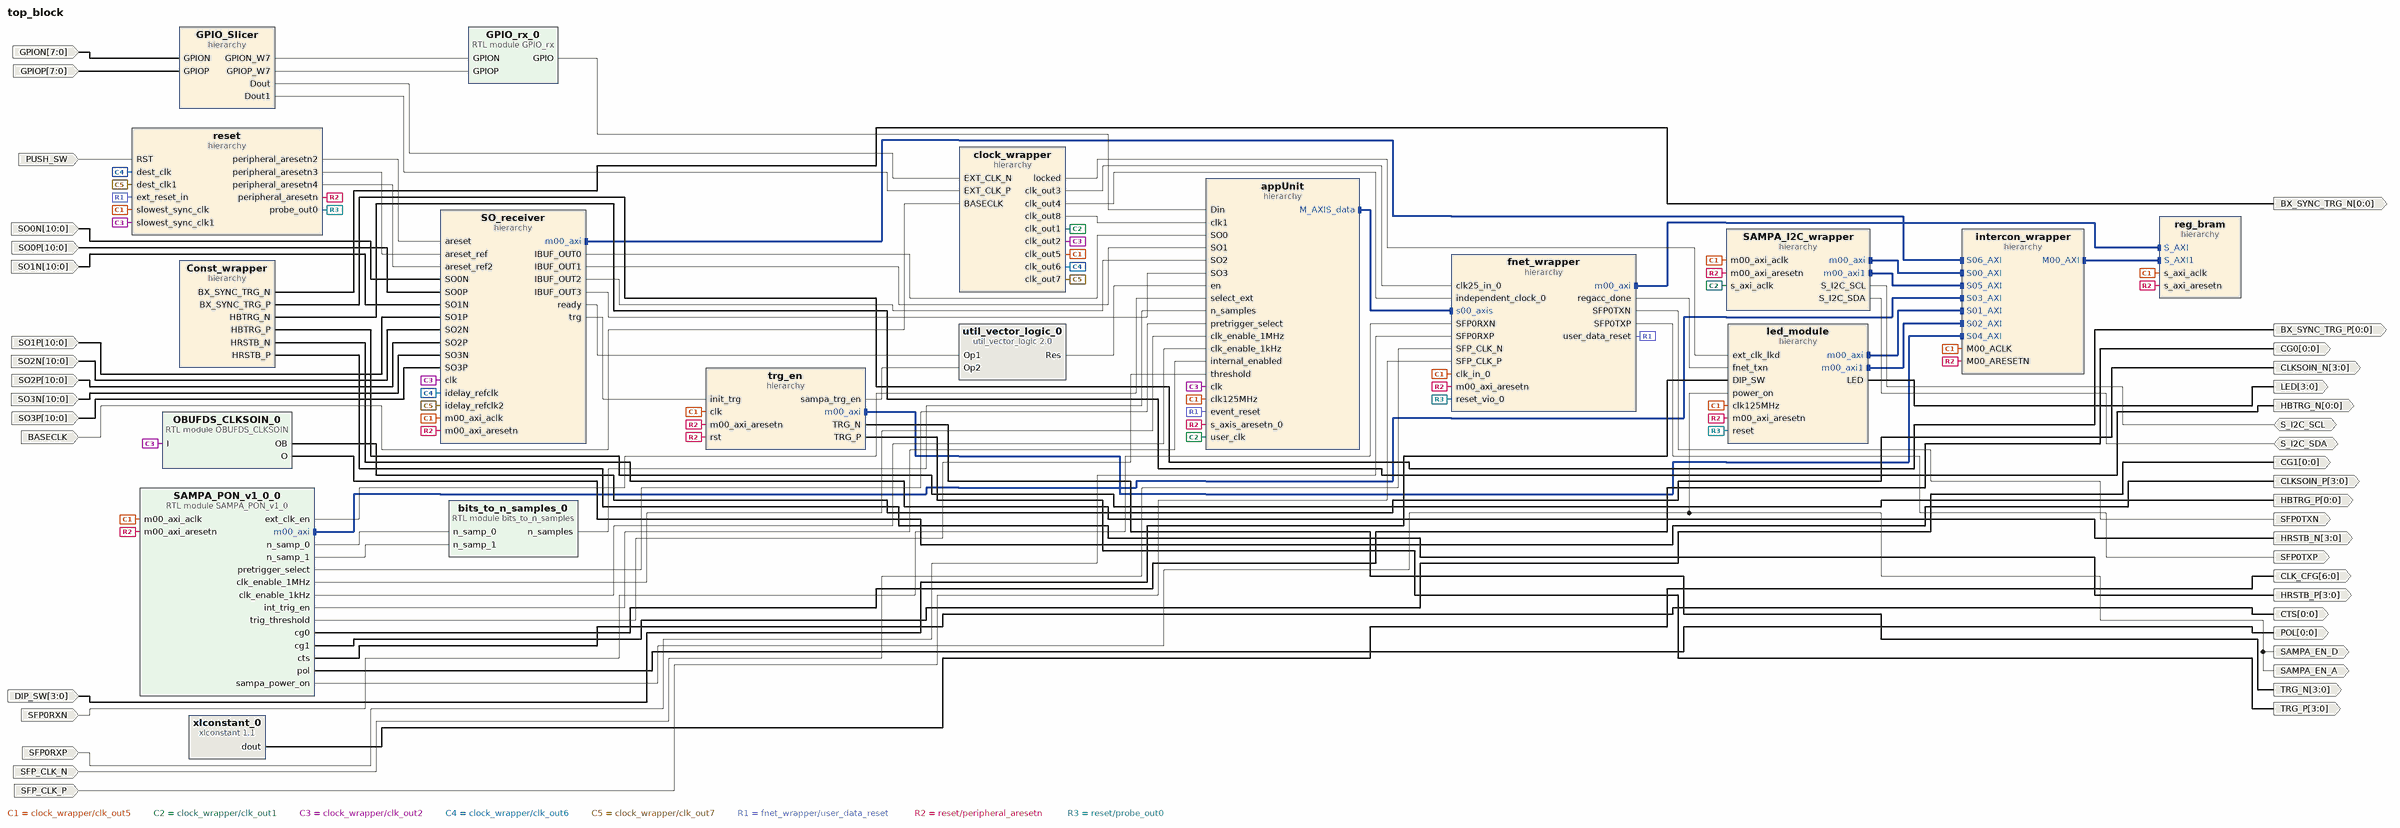
[diagram p0: block diagram of the top level]
# Vivado block design top_block, xcau15p-sbvb484-1-i, Vivado 2022.2
create_bd_design top_block

create_bd_port -dir I SFP0RXN
create_bd_port -dir O SFP0TXP
create_bd_port -dir O SFP0TXN
create_bd_port -dir I SFP0RXP
create_bd_port -dir I -type clk BASECLK
set_property -dict {CONFIG.FREQ_HZ 40000000} [get_bd_ports BASECLK]
create_bd_port -dir O -from 3 -to 0 LED
create_bd_port -dir I -from 10 -to 0 -type data SO1P
create_bd_port -dir I -from 10 -to 0 -type data SO1N
create_bd_port -dir I -from 10 -to 0 -type data SO0N
create_bd_port -dir I -from 10 -to 0 -type data SO0P
create_bd_port -dir I -from 10 -to 0 -type data SO2N
create_bd_port -dir I -from 10 -to 0 -type data SO2P
create_bd_port -dir I -from 10 -to 0 -type data SO3N
create_bd_port -dir I -from 10 -to 0 -type data SO3P
create_bd_port -dir O -from 3 -to 0 TRG_N
create_bd_port -dir O -from 3 -to 0 TRG_P
create_bd_port -dir O SAMPA_EN_A
create_bd_port -dir O SAMPA_EN_D
create_bd_port -dir O -from 6 -to 0 CLK_CFG
create_bd_port -dir O -from 3 -to 0 -type clk CLKSOIN_P
create_bd_port -dir O -from 3 -to 0 -type clk CLKSOIN_N
create_bd_port -dir I -type rst PUSH_SW
create_bd_port -dir IO S_I2C_SDA
create_bd_port -dir IO S_I2C_SCL
create_bd_port -dir O -from 0 -to 0 BX_SYNC_TRG_P
create_bd_port -dir O -from 0 -to 0 BX_SYNC_TRG_N
create_bd_port -dir O -from 0 -to 0 HBTRG_P
create_bd_port -dir O -from 0 -to 0 HBTRG_N
create_bd_port -dir O -from 3 -to 0 HRSTB_N
create_bd_port -dir O -from 3 -to 0 HRSTB_P
create_bd_port -dir O -from 0 -to 0 CTS
create_bd_port -dir O -from 0 -to 0 POL
create_bd_port -dir O -from 0 -to 0 CG0
create_bd_port -dir O -from 0 -to 0 CG1
create_bd_port -dir I -from 3 -to 0 DIP_SW
create_bd_port -dir I -type clk SFP_CLK_P
set_property -dict {CONFIG.FREQ_HZ 156250000} [get_bd_ports SFP_CLK_P]
create_bd_port -dir I -type clk SFP_CLK_N
set_property -dict {CONFIG.FREQ_HZ 156250000} [get_bd_ports SFP_CLK_N]
create_bd_port -dir I -from 7 -to 0 GPIOP
create_bd_port -dir I -from 7 -to 0 GPION

create_bd_cell -type hier led_module
create_bd_cell -type hier reset
create_bd_cell -type hier reg_bram
create_bd_cell -type hier SAMPA_I2C_wrapper
create_bd_cell -type ip -vlnv xilinx.com:ip:xlconstant:1.1 xlconstant_0
set_property -dict {CONFIG.CONST_VAL 0b1010011 CONFIG.CONST_WIDTH 7} [get_bd_cells xlconstant_0]
create_bd_cell -type hier appUnit
create_bd_cell -type hier fnet_wrapper
create_bd_cell -type hier clock_wrapper
create_bd_cell -type hier SO_receiver
create_bd_cell -type hier trg_en
create_bd_cell -type hier intercon_wrapper
create_bd_cell -type module -reference OBUFDS_CLKSOIN OBUFDS_CLKSOIN_0
create_bd_cell -type ip -vlnv xilinx.com:ip:util_vector_logic:2.0 util_vector_logic_0
set_property -dict {CONFIG.C_SIZE 1} [get_bd_cells util_vector_logic_0]
create_bd_cell -type module -reference bits_to_n_samples bits_to_n_samples_0
create_bd_cell -type hier Const_wrapper
create_bd_cell -type module -reference SAMPA_PON_v1_0 SAMPA_PON_v1_0_0
set_property -dict [list \
  CONFIG.C_M00_AXI_TARGET_SLAVE_BASE_ADDR 0xC0000000 \
  CONFIG.POWER_ON_ADDRESS 0x00000800 \
] [get_bd_cells SAMPA_PON_v1_0_0]
create_bd_cell -type module -reference GPIO_rx GPIO_rx_0
create_bd_cell -type hier GPIO_Slicer

# ---- hierarchy /led_module ----
current_bd_instance /led_module
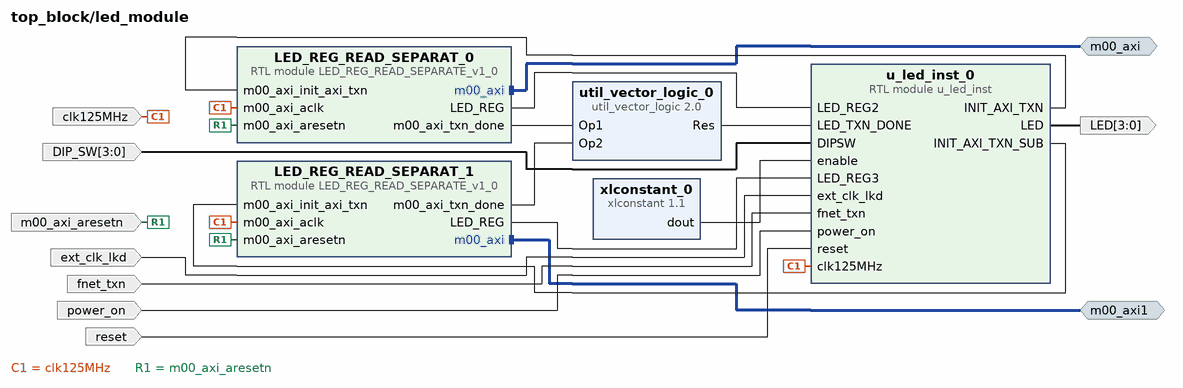
[diagram p1: block diagram inside /led_module]
create_bd_intf_pin -mode Master -vlnv xilinx.com:interface:aximm_rtl:1.0 m00_axi
create_bd_intf_pin -mode Master -vlnv xilinx.com:interface:aximm_rtl:1.0 m00_axi1
create_bd_pin -dir I -type rst reset
create_bd_pin -dir O -from 3 -to 0 LED
create_bd_pin -dir I clk125MHz
create_bd_pin -dir I -type rst m00_axi_aresetn
create_bd_pin -dir I fnet_txn
create_bd_pin -dir I power_on
create_bd_pin -dir I -from 3 -to 0 DIP_SW
create_bd_pin -dir I ext_clk_lkd

create_bd_cell -type ip -vlnv xilinx.com:ip:util_vector_logic:2.0 util_vector_logic_0
set_property -dict {CONFIG.C_OPERATION or CONFIG.C_SIZE 1} [get_bd_cells util_vector_logic_0]
create_bd_cell -type ip -vlnv xilinx.com:ip:xlconstant:1.1 xlconstant_0
create_bd_cell -type module -reference LED_REG_READ_SEPARATE_v1_0 LED_REG_READ_SEPARAT_0
set_property -dict [list \
  CONFIG.C_M00_AXI_TARGET_SLAVE_BASE_ADDR 0xC0000000 \
  CONFIG.LED_ADDRESS 0x00000F02 \
] [get_bd_cells LED_REG_READ_SEPARAT_0]
create_bd_cell -type module -reference LED_REG_READ_SEPARATE_v1_0 LED_REG_READ_SEPARAT_1
set_property -dict [list \
  CONFIG.C_M00_AXI_TARGET_SLAVE_BASE_ADDR 0xC0000000 \
  CONFIG.LED_ADDRESS 0x00000F03 \
] [get_bd_cells LED_REG_READ_SEPARAT_1]
create_bd_cell -type module -reference u_led_inst u_led_inst_0

# ---- hierarchy /reset ----
current_bd_instance /reset
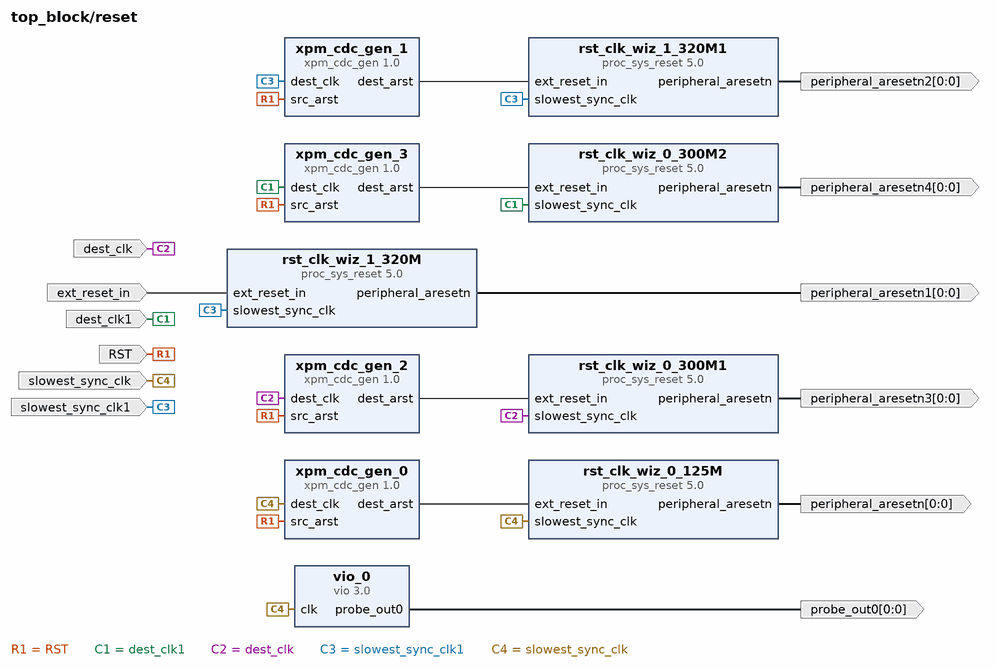
[diagram p2: block diagram inside /reset]
create_bd_pin -dir O -from 0 -to 0 probe_out0
create_bd_pin -dir I -type clk slowest_sync_clk
create_bd_pin -dir O -from 0 -to 0 -type rst peripheral_aresetn
create_bd_pin -dir I RST
create_bd_pin -dir I -type clk slowest_sync_clk1
create_bd_pin -dir O -from 0 -to 0 -type rst peripheral_aresetn1
create_bd_pin -dir I -type rst ext_reset_in
create_bd_pin -dir O -from 0 -to 0 -type rst peripheral_aresetn2
create_bd_pin -dir O -from 0 -to 0 -type rst peripheral_aresetn3
create_bd_pin -dir I -type clk dest_clk
create_bd_pin -dir I -type clk dest_clk1
create_bd_pin -dir O -from 0 -to 0 -type rst peripheral_aresetn4

create_bd_cell -type ip -vlnv xilinx.com:ip:vio:3.0 vio_0
set_property -dict {CONFIG.C_NUM_PROBE_IN 0} [get_bd_cells vio_0]
create_bd_cell -type ip -vlnv xilinx.com:ip:proc_sys_reset:5.0 rst_clk_wiz_0_125M
create_bd_cell -type ip -vlnv xilinx.com:ip:xpm_cdc_gen:1.0 xpm_cdc_gen_0
set_property -dict {CONFIG.CDC_TYPE xpm_cdc_async_rst CONFIG.DEST_SYNC_FF 8} [get_bd_cells xpm_cdc_gen_0]
create_bd_cell -type ip -vlnv xilinx.com:ip:proc_sys_reset:5.0 rst_clk_wiz_1_320M
create_bd_cell -type ip -vlnv xilinx.com:ip:proc_sys_reset:5.0 rst_clk_wiz_1_320M1
create_bd_cell -type ip -vlnv xilinx.com:ip:xpm_cdc_gen:1.0 xpm_cdc_gen_1
set_property -dict {CONFIG.CDC_TYPE xpm_cdc_async_rst} [get_bd_cells xpm_cdc_gen_1]
create_bd_cell -type ip -vlnv xilinx.com:ip:xpm_cdc_gen:1.0 xpm_cdc_gen_2
set_property -dict {CONFIG.CDC_TYPE xpm_cdc_async_rst CONFIG.DEST_SYNC_FF 8} [get_bd_cells xpm_cdc_gen_2]
create_bd_cell -type ip -vlnv xilinx.com:ip:proc_sys_reset:5.0 rst_clk_wiz_0_300M1
create_bd_cell -type ip -vlnv xilinx.com:ip:proc_sys_reset:5.0 rst_clk_wiz_0_300M2
create_bd_cell -type ip -vlnv xilinx.com:ip:xpm_cdc_gen:1.0 xpm_cdc_gen_3
set_property -dict {CONFIG.CDC_TYPE xpm_cdc_async_rst CONFIG.DEST_SYNC_FF 8} [get_bd_cells xpm_cdc_gen_3]

# ---- hierarchy /reg_bram ----
current_bd_instance /reg_bram
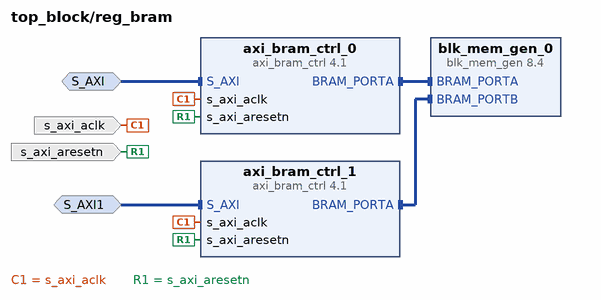
[diagram p3: block diagram inside /reg_bram]
create_bd_intf_pin -mode Slave -vlnv xilinx.com:interface:aximm_rtl:1.0 S_AXI
create_bd_intf_pin -mode Slave -vlnv xilinx.com:interface:aximm_rtl:1.0 S_AXI1
create_bd_pin -dir I -type rst s_axi_aresetn
create_bd_pin -dir I -type clk s_axi_aclk

create_bd_cell -type ip -vlnv xilinx.com:ip:axi_bram_ctrl:4.1 axi_bram_ctrl_0
set_property -dict {CONFIG.PROTOCOL AXI4LITE CONFIG.SINGLE_PORT_BRAM 1} [get_bd_cells axi_bram_ctrl_0]
create_bd_cell -type ip -vlnv xilinx.com:ip:blk_mem_gen:8.4 blk_mem_gen_0
set_property -dict {CONFIG.Memory_Type True_Dual_Port_RAM} [get_bd_cells blk_mem_gen_0]
create_bd_cell -type ip -vlnv xilinx.com:ip:axi_bram_ctrl:4.1 axi_bram_ctrl_1
set_property -dict {CONFIG.PROTOCOL AXI4LITE CONFIG.SINGLE_PORT_BRAM 1} [get_bd_cells axi_bram_ctrl_1]

# ---- hierarchy /SAMPA_I2C_wrapper ----
current_bd_instance /SAMPA_I2C_wrapper
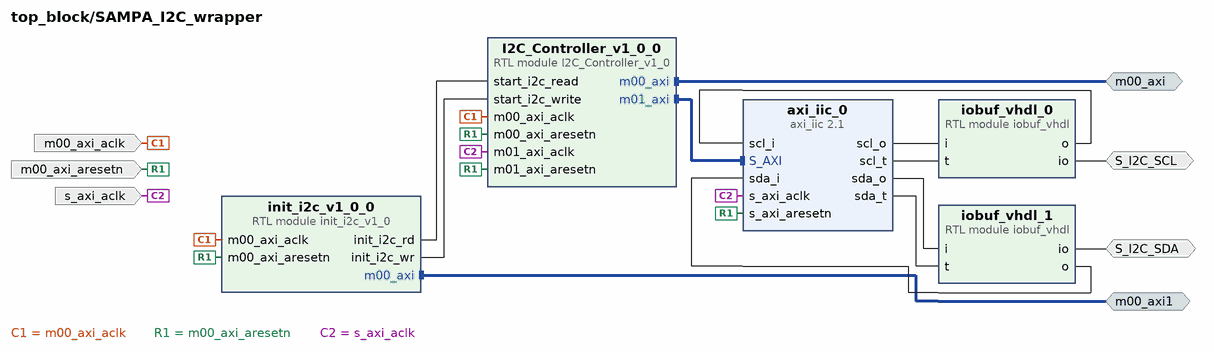
[diagram p4: block diagram inside /SAMPA_I2C_wrapper]
create_bd_intf_pin -mode Master -vlnv xilinx.com:interface:aximm_rtl:1.0 m00_axi
create_bd_intf_pin -mode Master -vlnv xilinx.com:interface:aximm_rtl:1.0 m00_axi1
create_bd_pin -dir I -type rst m00_axi_aresetn
create_bd_pin -dir I -type clk m00_axi_aclk
create_bd_pin -dir I -type clk s_axi_aclk
create_bd_pin -dir IO S_I2C_SDA
create_bd_pin -dir IO S_I2C_SCL

create_bd_cell -type ip -vlnv xilinx.com:ip:axi_iic:2.1 axi_iic_0
set_property -dict {CONFIG.C_SDA_LEVEL 0 CONFIG.IIC_FREQ_KHZ 1000 CONFIG.TEN_BIT_ADR 10_bit} [get_bd_cells axi_iic_0]
create_bd_cell -type module -reference iobuf_vhdl iobuf_vhdl_0
create_bd_cell -type module -reference iobuf_vhdl iobuf_vhdl_1
create_bd_cell -type module -reference I2C_Controller_v1_0 I2C_Controller_v1_0_0
set_property -dict [list \
  CONFIG.C_M00_AXI_TARGET_SLAVE_BASE_ADDR 0xC0000000 \
  CONFIG.C_M01_AXI_TARGET_SLAVE_BASE_ADDR 0x40000000 \
] [get_bd_cells I2C_Controller_v1_0_0]
create_bd_cell -type module -reference init_i2c_v1_0 init_i2c_v1_0_0
set_property -dict [list \
  CONFIG.C_M00_AXI_TARGET_SLAVE_BASE_ADDR 0xC0000000 \
  CONFIG.TARGET_ADDRESS 0x00000400 \
  CONFIG.TXN_TIMING 0x0100000 \
] [get_bd_cells init_i2c_v1_0_0]

# ---- hierarchy /appUnit ----
current_bd_instance /appUnit
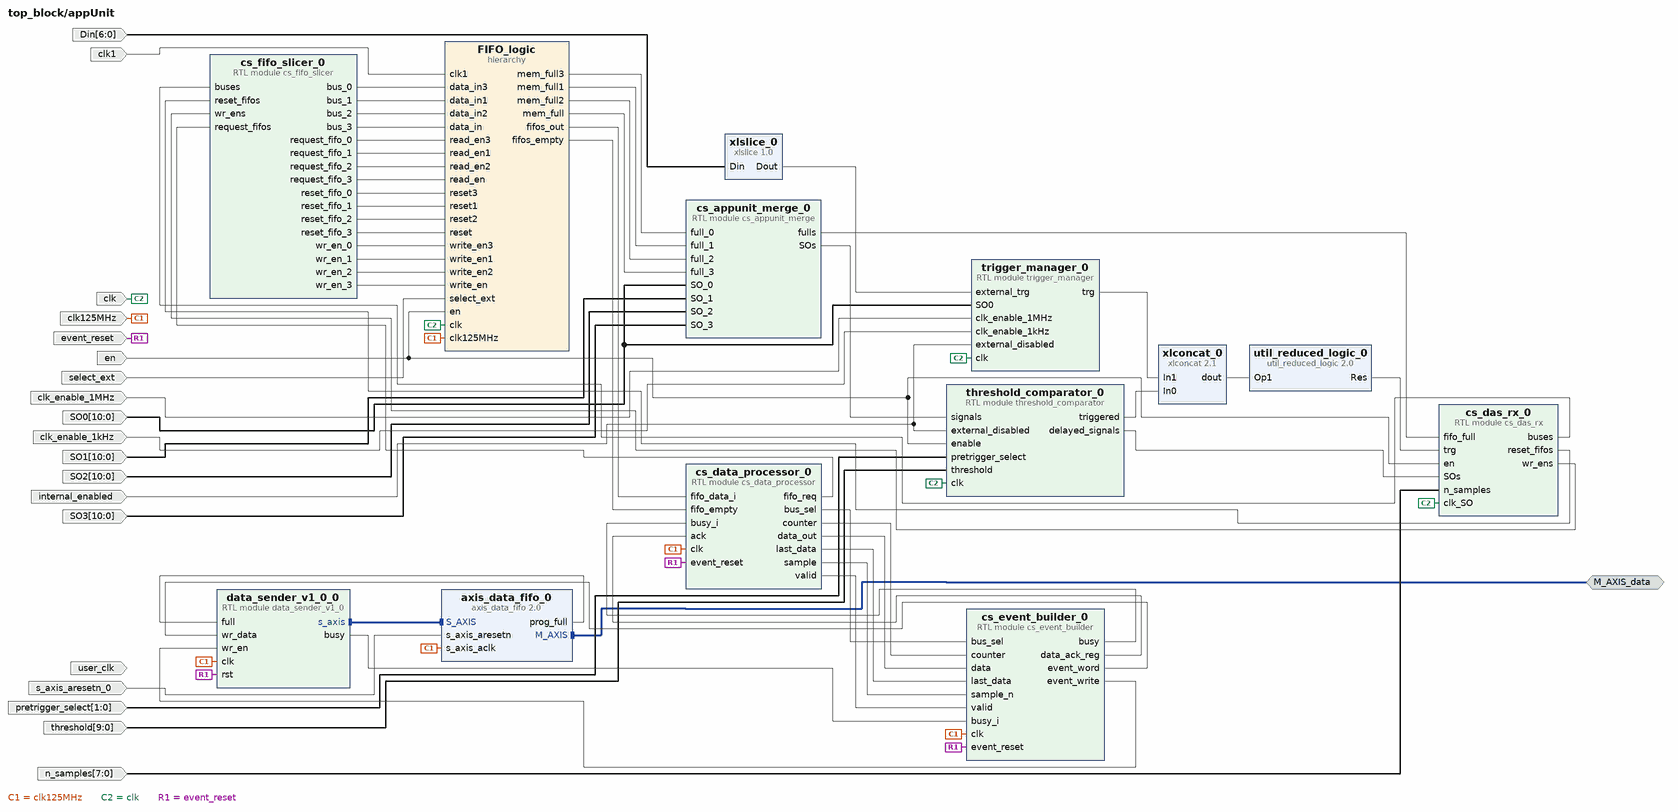
[diagram p5: block diagram inside /appUnit]
create_bd_intf_pin -mode Master -vlnv xilinx.com:interface:axis_rtl:1.0 M_AXIS_data
create_bd_pin -dir I -type clk clk
create_bd_pin -dir I -type clk user_clk
create_bd_pin -dir I -type rst event_reset
create_bd_pin -dir I -type clk clk125MHz
create_bd_pin -dir I -from 10 -to 0 SO1
create_bd_pin -dir I -from 10 -to 0 SO3
create_bd_pin -dir I -from 10 -to 0 SO2
create_bd_pin -dir I -from 10 -to 0 SO0
create_bd_pin -dir I en
create_bd_pin -dir I internal_enabled
create_bd_pin -dir I clk_enable_1kHz
create_bd_pin -dir I clk_enable_1MHz
create_bd_pin -dir I -type rst s_axis_aresetn_0
create_bd_pin -dir I -from 7 -to 0 n_samples
create_bd_pin -dir I -from 9 -to 0 threshold
create_bd_pin -dir I -from 1 -to 0 pretrigger_select
create_bd_pin -dir I -from 6 -to 0 Din
create_bd_pin -dir I -type clk clk1
create_bd_pin -dir I select_ext

create_bd_cell -type hier FIFO_logic
create_bd_cell -type module -reference data_sender_v1_0 data_sender_v1_0_0
create_bd_cell -type ip -vlnv xilinx.com:ip:axis_data_fifo:2.0 axis_data_fifo_0
set_property -dict {CONFIG.FIFO_DEPTH 128 CONFIG.HAS_PROG_FULL 1 CONFIG.PROG_FULL_THRESH 64} [get_bd_cells axis_data_fifo_0]
create_bd_cell -type module -reference cs_fifo_slicer cs_fifo_slicer_0
create_bd_cell -type module -reference cs_appunit_merge cs_appunit_merge_0
create_bd_cell -type ip -vlnv xilinx.com:ip:util_reduced_logic:2.0 util_reduced_logic_0
set_property -dict {CONFIG.C_OPERATION or CONFIG.C_SIZE 5} [get_bd_cells util_reduced_logic_0]
create_bd_cell -type ip -vlnv xilinx.com:ip:xlconcat:2.1 xlconcat_0
set_property -dict {CONFIG.IN0_WIDTH 4} [get_bd_cells xlconcat_0]
create_bd_cell -type module -reference cs_event_builder cs_event_builder_0
set_property -dict {CONFIG.BIT_SAMPLES 8} [get_bd_cells cs_event_builder_0]
create_bd_cell -type module -reference cs_data_processor cs_data_processor_0
set_property -dict {CONFIG.BIT_SAMPLES 8} [get_bd_cells cs_data_processor_0]
create_bd_cell -type module -reference cs_das_rx cs_das_rx_0
create_bd_cell -type module -reference threshold_comparator threshold_comparator_0
create_bd_cell -type module -reference trigger_manager trigger_manager_0
create_bd_cell -type ip -vlnv xilinx.com:ip:xlslice:1.0 xlslice_0
set_property -dict {CONFIG.DIN_WIDTH 7} [get_bd_cells xlslice_0]

# ---- hierarchy /appUnit/FIFO_logic ----
current_bd_instance /appUnit/FIFO_logic
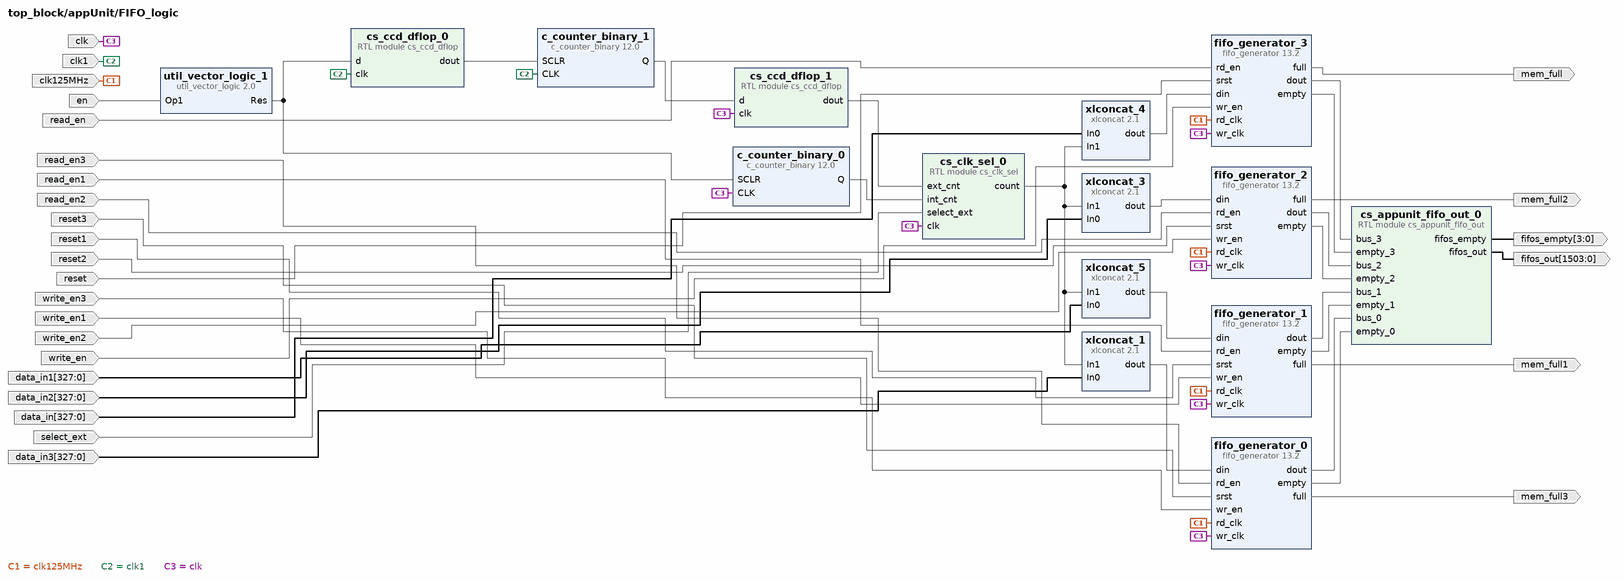
[diagram p6: block diagram inside /appUnit/FIFO_logic]
create_bd_pin -dir I -type clk clk
create_bd_pin -dir I -type clk clk125MHz
create_bd_pin -dir I -type rst reset1
create_bd_pin -dir I write_en1
create_bd_pin -dir I read_en1
create_bd_pin -dir O mem_full1
create_bd_pin -dir I -type rst reset2
create_bd_pin -dir I write_en2
create_bd_pin -dir I read_en2
create_bd_pin -dir O mem_full2
create_bd_pin -dir I -type rst reset3
create_bd_pin -dir I write_en3
create_bd_pin -dir I read_en3
create_bd_pin -dir O mem_full3
create_bd_pin -dir I -from 327 -to 0 data_in3
create_bd_pin -dir I -from 327 -to 0 data_in2
create_bd_pin -dir I -from 327 -to 0 data_in1
create_bd_pin -dir O -from 3 -to 0 fifos_empty
create_bd_pin -dir O -from 1503 -to 0 fifos_out
create_bd_pin -dir O mem_full
create_bd_pin -dir I -from 327 -to 0 data_in
create_bd_pin -dir I read_en
create_bd_pin -dir I write_en
create_bd_pin -dir I -type rst reset
create_bd_pin -dir I -type clk clk1
create_bd_pin -dir I -type ce en
create_bd_pin -dir I select_ext

create_bd_cell -type ip -vlnv xilinx.com:ip:xlconcat:2.1 xlconcat_4
set_property -dict {CONFIG.IN0_WIDTH 328 CONFIG.IN1_WIDTH 48} [get_bd_cells xlconcat_4]
create_bd_cell -type ip -vlnv xilinx.com:ip:xlconcat:2.1 xlconcat_5
set_property -dict {CONFIG.IN0_WIDTH 328 CONFIG.IN1_WIDTH 48} [get_bd_cells xlconcat_5]
create_bd_cell -type ip -vlnv xilinx.com:ip:xlconcat:2.1 xlconcat_3
set_property -dict {CONFIG.IN0_WIDTH 328 CONFIG.IN1_WIDTH 48} [get_bd_cells xlconcat_3]
create_bd_cell -type ip -vlnv xilinx.com:ip:xlconcat:2.1 xlconcat_1
set_property -dict {CONFIG.IN0_WIDTH 328 CONFIG.IN1_WIDTH 48} [get_bd_cells xlconcat_1]
create_bd_cell -type module -reference cs_appunit_fifo_out cs_appunit_fifo_out_0
create_bd_cell -type ip -vlnv xilinx.com:ip:c_counter_binary:12.0 c_counter_binary_0
set_property -dict {CONFIG.Output_Width 48 CONFIG.SCLR true} [get_bd_cells c_counter_binary_0]
create_bd_cell -type ip -vlnv xilinx.com:ip:fifo_generator:13.2 fifo_generator_0
set_property -dict [list \
  CONFIG.Fifo_Implementation Independent_Clocks_Builtin_FIFO \
  CONFIG.Input_Data_Width 376 \
  CONFIG.Input_Depth 1024 \
  CONFIG.Read_Clock_Frequency 125 \
  CONFIG.Use_Embedded_Registers false \
  CONFIG.Write_Clock_Frequency 320 \
] [get_bd_cells fifo_generator_0]
create_bd_cell -type ip -vlnv xilinx.com:ip:fifo_generator:13.2 fifo_generator_1
set_property -dict [list \
  CONFIG.Fifo_Implementation Independent_Clocks_Builtin_FIFO \
  CONFIG.Input_Data_Width 376 \
  CONFIG.Input_Depth 1024 \
  CONFIG.Read_Clock_Frequency 125 \
  CONFIG.Use_Embedded_Registers false \
  CONFIG.Write_Clock_Frequency 320 \
] [get_bd_cells fifo_generator_1]
create_bd_cell -type ip -vlnv xilinx.com:ip:fifo_generator:13.2 fifo_generator_2
set_property -dict [list \
  CONFIG.Fifo_Implementation Independent_Clocks_Builtin_FIFO \
  CONFIG.Input_Data_Width 376 \
  CONFIG.Input_Depth 1024 \
  CONFIG.Read_Clock_Frequency 125 \
  CONFIG.Use_Embedded_Registers false \
  CONFIG.Write_Clock_Frequency 320 \
] [get_bd_cells fifo_generator_2]
create_bd_cell -type ip -vlnv xilinx.com:ip:fifo_generator:13.2 fifo_generator_3
set_property -dict [list \
  CONFIG.Fifo_Implementation Independent_Clocks_Builtin_FIFO \
  CONFIG.Input_Data_Width 376 \
  CONFIG.Input_Depth 1024 \
  CONFIG.Read_Clock_Frequency 125 \
  CONFIG.Use_Embedded_Registers false \
  CONFIG.Write_Clock_Frequency 320 \
] [get_bd_cells fifo_generator_3]
create_bd_cell -type ip -vlnv xilinx.com:ip:c_counter_binary:12.0 c_counter_binary_1
set_property -dict {CONFIG.Output_Width 48 CONFIG.SCLR true} [get_bd_cells c_counter_binary_1]
create_bd_cell -type ip -vlnv xilinx.com:ip:util_vector_logic:2.0 util_vector_logic_1
set_property -dict {CONFIG.C_OPERATION not CONFIG.C_SIZE 1} [get_bd_cells util_vector_logic_1]
create_bd_cell -type module -reference cs_ccd_dflop cs_ccd_dflop_0
create_bd_cell -type module -reference cs_ccd_dflop cs_ccd_dflop_1
set_property -dict {CONFIG.WIDTH 48} [get_bd_cells cs_ccd_dflop_1]
create_bd_cell -type module -reference cs_clk_sel cs_clk_sel_0

# ---- hierarchy /fnet_wrapper ----
current_bd_instance /fnet_wrapper
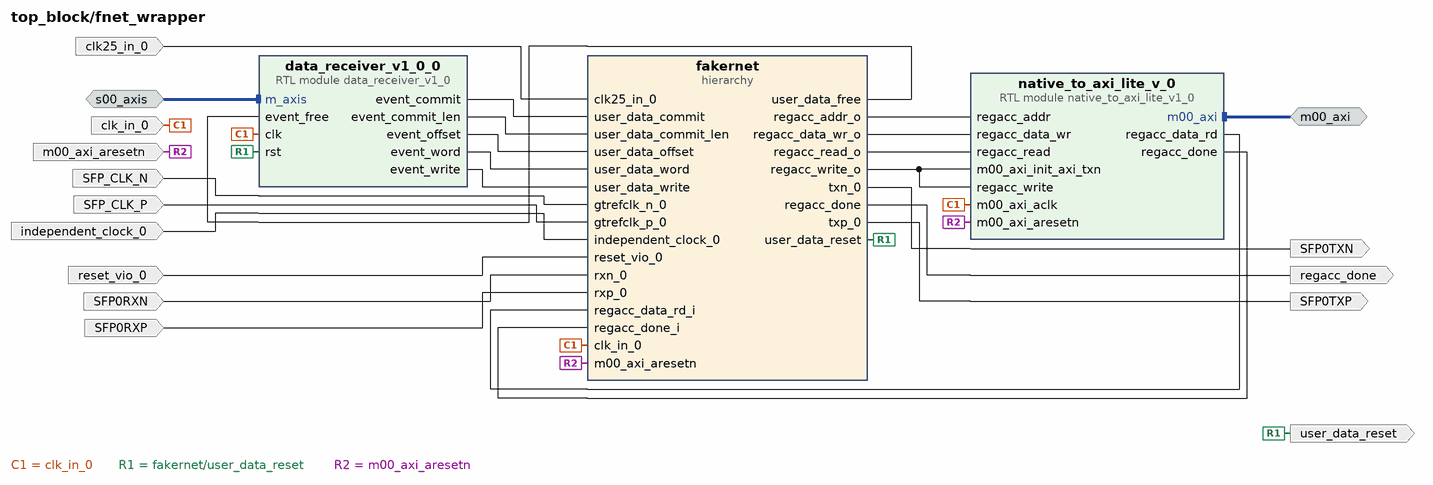
[diagram p7: block diagram inside /fnet_wrapper]
create_bd_intf_pin -mode Master -vlnv xilinx.com:interface:aximm_rtl:1.0 m00_axi
create_bd_intf_pin -mode Slave -vlnv xilinx.com:interface:axis_rtl:1.0 s00_axis
create_bd_pin -dir O -type rst user_data_reset
create_bd_pin -dir I clk25_in_0
create_bd_pin -dir I -type clk independent_clock_0
create_bd_pin -dir I clk_in_0
create_bd_pin -dir O regacc_done
create_bd_pin -dir I -type rst reset_vio_0
create_bd_pin -dir I -type rst m00_axi_aresetn
create_bd_pin -dir I SFP0RXN
create_bd_pin -dir O SFP0TXP
create_bd_pin -dir I SFP_CLK_P
create_bd_pin -dir I SFP_CLK_N
create_bd_pin -dir O SFP0TXN
create_bd_pin -dir I SFP0RXP

create_bd_cell -type hier fakernet
create_bd_cell -type module -reference native_to_axi_lite_v1_0 native_to_axi_lite_v_0
set_property -dict {CONFIG.C_M00_AXI_TARGET_SLAVE_BASE_ADDR 0xC0000000} [get_bd_cells native_to_axi_lite_v_0]
create_bd_cell -type module -reference data_receiver_v1_0 data_receiver_v1_0_0

# ---- hierarchy /fnet_wrapper/fakernet ----
current_bd_instance /fnet_wrapper/fakernet
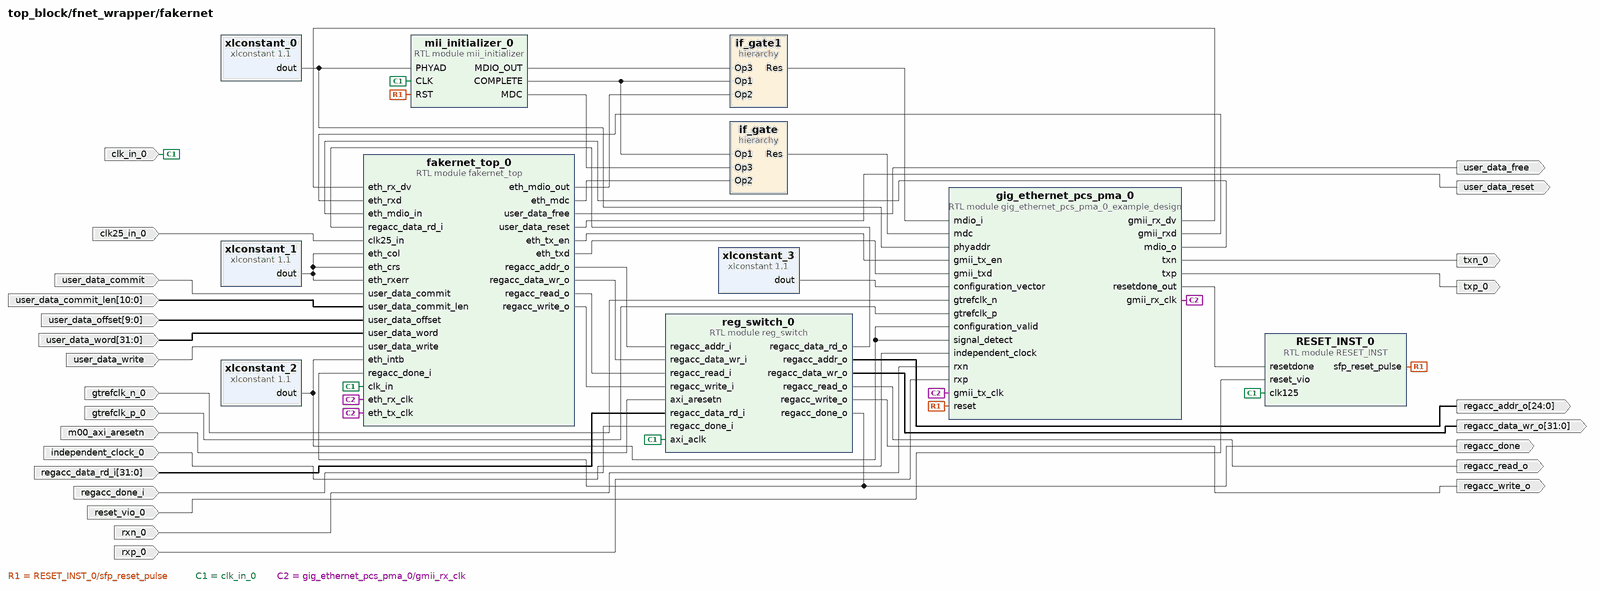
[diagram p8: block diagram inside /fnet_wrapper/fakernet]
create_bd_pin -dir I rxn_0
create_bd_pin -dir O txp_0
create_bd_pin -dir I gtrefclk_p_0
create_bd_pin -dir I gtrefclk_n_0
create_bd_pin -dir I -type clk independent_clock_0
create_bd_pin -dir O txn_0
create_bd_pin -dir I rxp_0
create_bd_pin -dir I clk25_in_0
create_bd_pin -dir I clk_in_0
create_bd_pin -dir I -type rst reset_vio_0
create_bd_pin -dir O -type rst user_data_reset
create_bd_pin -dir O user_data_free
create_bd_pin -dir I user_data_commit
create_bd_pin -dir I -from 10 -to 0 user_data_commit_len
create_bd_pin -dir I user_data_write
create_bd_pin -dir I -from 9 -to 0 user_data_offset
create_bd_pin -dir I -from 31 -to 0 user_data_word
create_bd_pin -dir I -type rst m00_axi_aresetn
create_bd_pin -dir O regacc_done
create_bd_pin -dir I -from 31 -to 0 regacc_data_rd_i
create_bd_pin -dir O -from 31 -to 0 regacc_data_wr_o
create_bd_pin -dir I regacc_done_i
create_bd_pin -dir O regacc_read_o
create_bd_pin -dir O -from 24 -to 0 regacc_addr_o
create_bd_pin -dir O regacc_write_o

create_bd_cell -type module -reference mii_initializer mii_initializer_0
create_bd_cell -type hier if_gate
create_bd_cell -type hier if_gate1
create_bd_cell -type ip -vlnv xilinx.com:ip:xlconstant:1.1 xlconstant_0
set_property -dict {CONFIG.CONST_VAL 1 CONFIG.CONST_WIDTH 5} [get_bd_cells xlconstant_0]
create_bd_cell -type ip -vlnv xilinx.com:ip:xlconstant:1.1 xlconstant_1
set_property -dict {CONFIG.CONST_VAL 0 CONFIG.CONST_WIDTH 1} [get_bd_cells xlconstant_1]
create_bd_cell -type ip -vlnv xilinx.com:ip:xlconstant:1.1 xlconstant_2
set_property -dict {CONFIG.CONST_VAL 1 CONFIG.CONST_WIDTH 1} [get_bd_cells xlconstant_2]
create_bd_cell -type ip -vlnv xilinx.com:ip:xlconstant:1.1 xlconstant_3
set_property -dict {CONFIG.CONST_VAL 0 CONFIG.CONST_WIDTH 5} [get_bd_cells xlconstant_3]
create_bd_cell -type module -reference RESET_INST RESET_INST_0
create_bd_cell -type module -reference gig_ethernet_pcs_pma_0_example_design gig_ethernet_pcs_pma_0
create_bd_cell -type module -reference reg_switch reg_switch_0
create_bd_cell -type module -reference fakernet_top fakernet_top_0

# ---- hierarchy /fnet_wrapper/fakernet/if_gate ----
current_bd_instance /fnet_wrapper/fakernet/if_gate
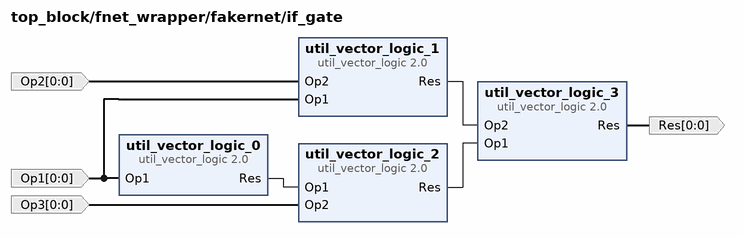
[diagram p9: block diagram inside /fnet_wrapper/fakernet/if_gate]
create_bd_pin -dir I -from 0 -to 0 Op1
create_bd_pin -dir I -from 0 -to 0 Op2
create_bd_pin -dir I -from 0 -to 0 Op3
create_bd_pin -dir O -from 0 -to 0 Res

create_bd_cell -type ip -vlnv xilinx.com:ip:util_vector_logic:2.0 util_vector_logic_0
set_property -dict {CONFIG.C_OPERATION not CONFIG.C_SIZE 1} [get_bd_cells util_vector_logic_0]
create_bd_cell -type ip -vlnv xilinx.com:ip:util_vector_logic:2.0 util_vector_logic_1
set_property -dict {CONFIG.C_SIZE 1} [get_bd_cells util_vector_logic_1]
create_bd_cell -type ip -vlnv xilinx.com:ip:util_vector_logic:2.0 util_vector_logic_2
set_property -dict {CONFIG.C_SIZE 1} [get_bd_cells util_vector_logic_2]
create_bd_cell -type ip -vlnv xilinx.com:ip:util_vector_logic:2.0 util_vector_logic_3
set_property -dict {CONFIG.C_OPERATION or CONFIG.C_SIZE 1} [get_bd_cells util_vector_logic_3]

# ---- hierarchy /fnet_wrapper/fakernet/if_gate1 ----
current_bd_instance /fnet_wrapper/fakernet/if_gate1
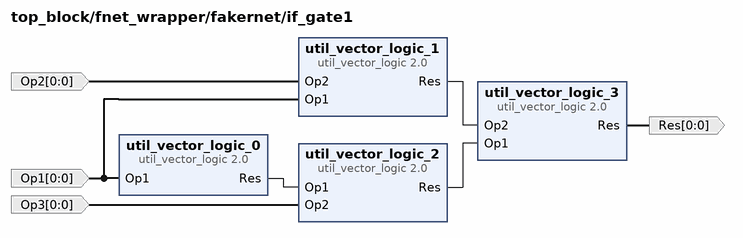
[diagram p10: block diagram inside /fnet_wrapper/fakernet/if_gate1]
create_bd_pin -dir I -from 0 -to 0 Op1
create_bd_pin -dir I -from 0 -to 0 Op2
create_bd_pin -dir I -from 0 -to 0 Op3
create_bd_pin -dir O -from 0 -to 0 Res

create_bd_cell -type ip -vlnv xilinx.com:ip:util_vector_logic:2.0 util_vector_logic_0
set_property -dict {CONFIG.C_OPERATION not CONFIG.C_SIZE 1} [get_bd_cells util_vector_logic_0]
create_bd_cell -type ip -vlnv xilinx.com:ip:util_vector_logic:2.0 util_vector_logic_1
set_property -dict {CONFIG.C_SIZE 1} [get_bd_cells util_vector_logic_1]
create_bd_cell -type ip -vlnv xilinx.com:ip:util_vector_logic:2.0 util_vector_logic_2
set_property -dict {CONFIG.C_SIZE 1} [get_bd_cells util_vector_logic_2]
create_bd_cell -type ip -vlnv xilinx.com:ip:util_vector_logic:2.0 util_vector_logic_3
set_property -dict {CONFIG.C_OPERATION or CONFIG.C_SIZE 1} [get_bd_cells util_vector_logic_3]

# ---- hierarchy /clock_wrapper ----
current_bd_instance /clock_wrapper
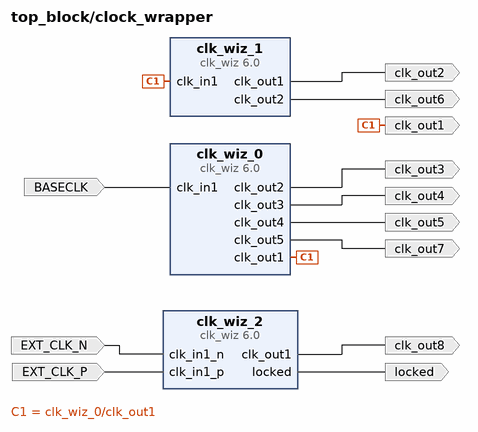
[diagram p11: block diagram inside /clock_wrapper]
create_bd_pin -dir O -type clk clk_out1
create_bd_pin -dir O -type clk clk_out3
create_bd_pin -dir O -type clk clk_out4
create_bd_pin -dir O -type clk clk_out5
create_bd_pin -dir I -type clk BASECLK
create_bd_pin -dir O -type clk clk_out2
create_bd_pin -dir O -type clk clk_out6
create_bd_pin -dir O -type clk clk_out7
create_bd_pin -dir I -type clk EXT_CLK_N
create_bd_pin -dir I -type clk EXT_CLK_P
create_bd_pin -dir O -type clk clk_out8
create_bd_pin -dir O locked

create_bd_cell -type ip -vlnv xilinx.com:ip:clk_wiz:6.0 clk_wiz_1
set_property -dict [list \
  CONFIG.AUTO_PRIMITIVE MMCM \
  CONFIG.CLKIN1_JITTER_PS 250.0 \
  CONFIG.CLKOUT1_DRIVES Buffer \
  CONFIG.CLKOUT1_JITTER 128.655 \
  CONFIG.CLKOUT1_PHASE_ERROR 166.174 \
  CONFIG.CLKOUT1_REQUESTED_OUT_FREQ 320.000 \
  CONFIG.CLKOUT2_DRIVES Buffer \
  CONFIG.CLKOUT2_JITTER 129.867 \
  CONFIG.CLKOUT2_MATCHED_ROUTING false \
  CONFIG.CLKOUT2_PHASE_ERROR 166.174 \
  CONFIG.CLKOUT2_REQUESTED_OUT_FREQ 300 \
  CONFIG.CLKOUT2_USED true \
  CONFIG.CLKOUT3_DRIVES Buffer \
  CONFIG.CLKOUT3_JITTER 121.907 \
  CONFIG.CLKOUT3_PHASE_ERROR 154.081 \
  CONFIG.CLKOUT3_REQUESTED_OUT_FREQ 100.000 \
  CONFIG.CLKOUT3_USED false \
  CONFIG.CLKOUT4_DRIVES Buffer \
  CONFIG.CLKOUT5_DRIVES Buffer \
  CONFIG.CLKOUT6_DRIVES Buffer \
  CONFIG.CLKOUT7_DRIVES Buffer \
  CONFIG.ENABLE_CLOCK_MONITOR false \
  CONFIG.FEEDBACK_SOURCE FDBK_AUTO \
  CONFIG.MMCM_BANDWIDTH OPTIMIZED \
  CONFIG.MMCM_CLKFBOUT_MULT_F 30.000 \
  CONFIG.MMCM_CLKIN1_PERIOD 25.000 \
  CONFIG.MMCM_CLKIN2_PERIOD 10.0 \
  CONFIG.MMCM_CLKOUT0_DIVIDE_F 3.750 \
  CONFIG.MMCM_CLKOUT1_DIVIDE 4 \
  CONFIG.MMCM_CLKOUT2_DIVIDE 1 \
  CONFIG.MMCM_COMPENSATION AUTO \
  CONFIG.NUM_OUT_CLKS 2 \
  CONFIG.OPTIMIZE_CLOCKING_STRUCTURE_EN true \
  CONFIG.PRIMITIVE Auto \
  CONFIG.PRIM_IN_FREQ 40.000 \
  CONFIG.PRIM_SOURCE Global_buffer \
  CONFIG.USE_DYN_PHASE_SHIFT false \
  CONFIG.USE_LOCKED false \
  CONFIG.USE_POWER_DOWN false \
  CONFIG.USE_RESET false \
  CONFIG.USE_SAFE_CLOCK_STARTUP false \
] [get_bd_cells clk_wiz_1]
create_bd_cell -type ip -vlnv xilinx.com:ip:clk_wiz:6.0 clk_wiz_0
set_property -dict [list \
  CONFIG.AUTO_PRIMITIVE MMCM \
  CONFIG.CLKIN1_JITTER_PS 250.0 \
  CONFIG.CLKOUT1_DRIVES Buffer \
  CONFIG.CLKOUT1_JITTER 139.963 \
  CONFIG.CLKOUT1_PHASE_ERROR 137.290 \
  CONFIG.CLKOUT1_REQUESTED_OUT_FREQ 40.000 \
  CONFIG.CLKOUT2_DRIVES Buffer \
  CONFIG.CLKOUT2_JITTER 149.805 \
  CONFIG.CLKOUT2_PHASE_ERROR 137.290 \
  CONFIG.CLKOUT2_REQUESTED_OUT_FREQ 25 \
  CONFIG.CLKOUT2_USED true \
  CONFIG.CLKOUT3_DRIVES Buffer \
  CONFIG.CLKOUT3_JITTER 135.568 \
  CONFIG.CLKOUT3_PHASE_ERROR 137.290 \
  CONFIG.CLKOUT3_REQUESTED_OUT_FREQ 50 \
  CONFIG.CLKOUT3_USED true \
  CONFIG.CLKOUT4_DRIVES Buffer \
  CONFIG.CLKOUT4_JITTER 119.250 \
  CONFIG.CLKOUT4_PHASE_ERROR 137.290 \
  CONFIG.CLKOUT4_REQUESTED_OUT_FREQ 125 \
  CONFIG.CLKOUT4_USED true \
  CONFIG.CLKOUT5_DRIVES Buffer \
  CONFIG.CLKOUT5_JITTER 106.014 \
  CONFIG.CLKOUT5_PHASE_ERROR 137.290 \
  CONFIG.CLKOUT5_REQUESTED_OUT_FREQ 300 \
  CONFIG.CLKOUT5_USED true \
  CONFIG.CLKOUT6_DRIVES Buffer \
  CONFIG.CLKOUT6_JITTER 180.876 \
  CONFIG.CLKOUT6_PHASE_ERROR 191.950 \
  CONFIG.CLKOUT6_REQUESTED_OUT_FREQ 100.0 \
  CONFIG.CLKOUT6_USED false \
  CONFIG.CLKOUT7_DRIVES Buffer \
  CONFIG.FEEDBACK_SOURCE FDBK_AUTO \
  CONFIG.MMCM_BANDWIDTH OPTIMIZED \
  CONFIG.MMCM_CLKFBOUT_MULT_F 37.500 \
  CONFIG.MMCM_CLKIN1_PERIOD 25.000 \
  CONFIG.MMCM_CLKIN2_PERIOD 10.0 \
  CONFIG.MMCM_CLKOUT0_DIVIDE_F 37.500 \
  CONFIG.MMCM_CLKOUT1_DIVIDE 60 \
  CONFIG.MMCM_CLKOUT2_DIVIDE 30 \
  CONFIG.MMCM_CLKOUT3_DIVIDE 12 \
  CONFIG.MMCM_CLKOUT4_DIVIDE 5 \
  CONFIG.MMCM_CLKOUT5_DIVIDE 1 \
  CONFIG.MMCM_COMPENSATION AUTO \
  CONFIG.NUM_OUT_CLKS 5 \
  CONFIG.OPTIMIZE_CLOCKING_STRUCTURE_EN true \
  CONFIG.PRIMITIVE Auto \
  CONFIG.PRIM_IN_FREQ 40.000 \
  CONFIG.USE_LOCKED false \
  CONFIG.USE_RESET false \
] [get_bd_cells clk_wiz_0]
create_bd_cell -type ip -vlnv xilinx.com:ip:clk_wiz:6.0 clk_wiz_2
set_property -dict [list \
  CONFIG.AUTO_PRIMITIVE PLL \
  CONFIG.CLKIN1_JITTER_PS 80.0 \
  CONFIG.CLKOUT1_DRIVES Buffer \
  CONFIG.CLKOUT1_JITTER 128.871 \
  CONFIG.CLKOUT1_PHASE_ERROR 112.379 \
  CONFIG.CLKOUT1_REQUESTED_OUT_FREQ 125.000 \
  CONFIG.CLKOUT2_DRIVES Buffer \
  CONFIG.CLKOUT2_REQUESTED_OUT_FREQ 125.000 \
  CONFIG.CLKOUT3_DRIVES Buffer \
  CONFIG.CLKOUT3_REQUESTED_OUT_FREQ 125.000 \
  CONFIG.CLKOUT4_DRIVES Buffer \
  CONFIG.CLKOUT4_REQUESTED_OUT_FREQ 125.000 \
  CONFIG.CLKOUT5_DRIVES Buffer \
  CONFIG.CLKOUT5_REQUESTED_OUT_FREQ 125.000 \
  CONFIG.CLKOUT6_DRIVES Buffer \
  CONFIG.CLKOUT6_REQUESTED_OUT_FREQ 125.000 \
  CONFIG.CLKOUT7_DRIVES Buffer \
  CONFIG.CLKOUT7_REQUESTED_OUT_FREQ 125.000 \
  CONFIG.FEEDBACK_SOURCE FDBK_AUTO \
  CONFIG.MMCM_BANDWIDTH OPTIMIZED \
  CONFIG.MMCM_CLKFBOUT_MULT_F 6 \
  CONFIG.MMCM_CLKIN1_PERIOD 8.0 \
  CONFIG.MMCM_CLKIN2_PERIOD 10.0 \
  CONFIG.MMCM_CLKOUT0_DIVIDE_F 6 \
  CONFIG.MMCM_COMPENSATION AUTO \
  CONFIG.OPTIMIZE_CLOCKING_STRUCTURE_EN true \
  CONFIG.PRIMITIVE Auto \
  CONFIG.PRIM_IN_FREQ 125.000 \
  CONFIG.PRIM_SOURCE Differential_clock_capable_pin \
  CONFIG.USE_FREQ_SYNTH false \
  CONFIG.USE_LOCKED true \
  CONFIG.USE_RESET false \
] [get_bd_cells clk_wiz_2]

# ---- hierarchy /SO_receiver ----
current_bd_instance /SO_receiver
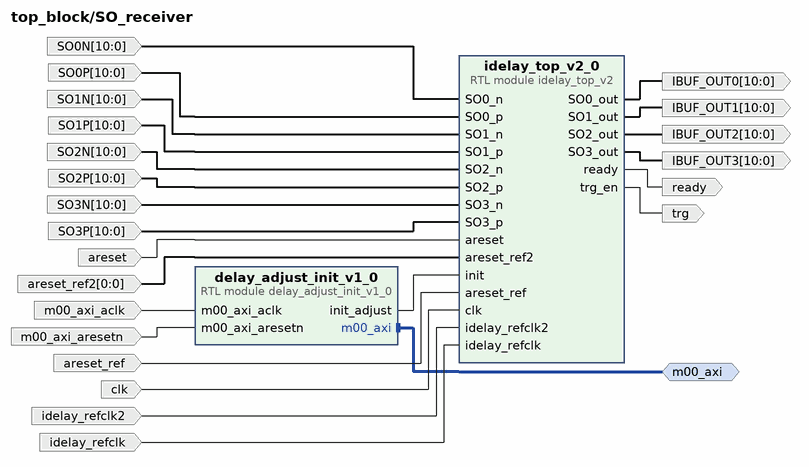
[diagram p12: block diagram inside /SO_receiver]
create_bd_intf_pin -mode Master -vlnv xilinx.com:interface:aximm_rtl:1.0 m00_axi
create_bd_pin -dir I -from 10 -to 0 -type clk SO1P
create_bd_pin -dir I -from 10 -to 0 -type clk SO1N
create_bd_pin -dir I -from 10 -to 0 -type clk SO0N
create_bd_pin -dir I -from 10 -to 0 -type clk SO0P
create_bd_pin -dir I -from 10 -to 0 -type clk SO2N
create_bd_pin -dir I -from 10 -to 0 -type clk SO2P
create_bd_pin -dir I -from 10 -to 0 -type clk SO3N
create_bd_pin -dir I -from 10 -to 0 -type clk SO3P
create_bd_pin -dir O -from 10 -to 0 IBUF_OUT1
create_bd_pin -dir O -from 10 -to 0 IBUF_OUT3
create_bd_pin -dir O -from 10 -to 0 IBUF_OUT2
create_bd_pin -dir O -from 10 -to 0 IBUF_OUT0
create_bd_pin -dir I -type clk clk
create_bd_pin -dir I -type clk idelay_refclk
create_bd_pin -dir O trg
create_bd_pin -dir I -type clk m00_axi_aclk
create_bd_pin -dir I -type rst m00_axi_aresetn
create_bd_pin -dir I areset
create_bd_pin -dir I areset_ref
create_bd_pin -dir I -from 0 -to 0 -type rst areset_ref2
create_bd_pin -dir I idelay_refclk2
create_bd_pin -dir O ready

create_bd_cell -type module -reference delay_adjust_init_v1_0 delay_adjust_init_v1_0
set_property -dict [list \
  CONFIG.C_M00_AXI_TARGET_SLAVE_BASE_ADDR 0xC0000000 \
  CONFIG.TARGET_ADDRESS 0x00001000 \
] [get_bd_cells delay_adjust_init_v1_0]
create_bd_cell -type module -reference idelay_top_v2 idelay_top_v2_0

# ---- hierarchy /trg_en ----
current_bd_instance /trg_en
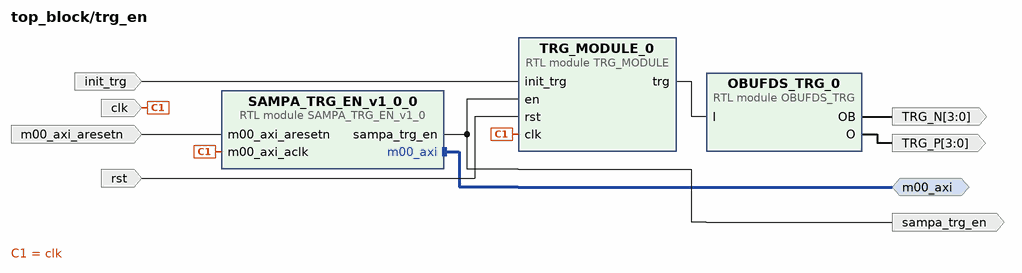
[diagram p13: block diagram inside /trg_en]
create_bd_intf_pin -mode Master -vlnv xilinx.com:interface:aximm_rtl:1.0 m00_axi
create_bd_pin -dir I -type rst rst
create_bd_pin -dir I init_trg
create_bd_pin -dir I -type clk clk
create_bd_pin -dir I -type rst m00_axi_aresetn
create_bd_pin -dir O -from 3 -to 0 -type clk TRG_N
create_bd_pin -dir O -from 3 -to 0 -type clk TRG_P
create_bd_pin -dir O sampa_trg_en

create_bd_cell -type module -reference SAMPA_TRG_EN_v1_0 SAMPA_TRG_EN_v1_0_0
set_property -dict [list \
  CONFIG.C_M00_AXI_TARGET_SLAVE_BASE_ADDR 0xC0000000 \
  CONFIG.TARGET_ADDRESS 0x00000500 \
  CONFIG.TXN_TIMING 0x0200000 \
] [get_bd_cells SAMPA_TRG_EN_v1_0_0]
create_bd_cell -type module -reference OBUFDS_TRG OBUFDS_TRG_0
create_bd_cell -type module -reference TRG_MODULE TRG_MODULE_0

# ---- hierarchy /intercon_wrapper ----
current_bd_instance /intercon_wrapper
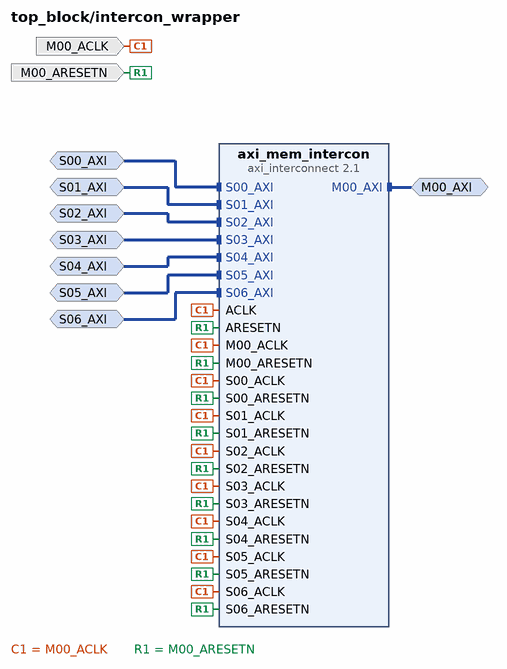
[diagram p14: block diagram inside /intercon_wrapper]
create_bd_intf_pin -mode Slave -vlnv xilinx.com:interface:aximm_rtl:1.0 S00_AXI
create_bd_intf_pin -mode Slave -vlnv xilinx.com:interface:aximm_rtl:1.0 S01_AXI
create_bd_intf_pin -mode Slave -vlnv xilinx.com:interface:aximm_rtl:1.0 S02_AXI
create_bd_intf_pin -mode Master -vlnv xilinx.com:interface:aximm_rtl:1.0 M00_AXI
create_bd_intf_pin -mode Slave -vlnv xilinx.com:interface:aximm_rtl:1.0 S03_AXI
create_bd_intf_pin -mode Slave -vlnv xilinx.com:interface:aximm_rtl:1.0 S04_AXI
create_bd_intf_pin -mode Slave -vlnv xilinx.com:interface:aximm_rtl:1.0 S05_AXI
create_bd_intf_pin -mode Slave -vlnv xilinx.com:interface:aximm_rtl:1.0 S06_AXI
create_bd_pin -dir I -type rst M00_ARESETN
create_bd_pin -dir I -type clk M00_ACLK

create_bd_cell -type ip -vlnv xilinx.com:ip:axi_interconnect:2.1 axi_mem_intercon
set_property -dict [list \
  CONFIG.M00_HAS_DATA_FIFO 1 \
  CONFIG.M00_HAS_REGSLICE 3 \
  CONFIG.NUM_MI 1 \
  CONFIG.NUM_SI 7 \
  CONFIG.S00_HAS_REGSLICE 3 \
  CONFIG.S01_HAS_REGSLICE 3 \
  CONFIG.S02_HAS_REGSLICE 3 \
  CONFIG.S03_HAS_REGSLICE 3 \
  CONFIG.S04_HAS_REGSLICE 3 \
  CONFIG.S05_HAS_REGSLICE 3 \
] [get_bd_cells axi_mem_intercon]

# ---- hierarchy /Const_wrapper ----
current_bd_instance /Const_wrapper
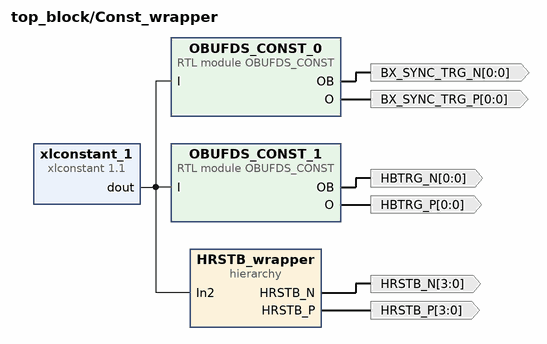
[diagram p15: block diagram inside /Const_wrapper]
create_bd_pin -dir O -from 0 -to 0 -type clk BX_SYNC_TRG_P
create_bd_pin -dir O -from 0 -to 0 -type clk BX_SYNC_TRG_N
create_bd_pin -dir O -from 0 -to 0 -type clk HBTRG_P
create_bd_pin -dir O -from 0 -to 0 -type clk HBTRG_N
create_bd_pin -dir O -from 3 -to 0 -type clk HRSTB_N
create_bd_pin -dir O -from 3 -to 0 -type clk HRSTB_P

create_bd_cell -type ip -vlnv xilinx.com:ip:xlconstant:1.1 xlconstant_1
set_property -dict {CONFIG.CONST_VAL 0} [get_bd_cells xlconstant_1]
create_bd_cell -type hier HRSTB_wrapper
create_bd_cell -type module -reference OBUFDS_CONST OBUFDS_CONST_1
create_bd_cell -type module -reference OBUFDS_CONST OBUFDS_CONST_0

# ---- hierarchy /Const_wrapper/HRSTB_wrapper ----
current_bd_instance /Const_wrapper/HRSTB_wrapper
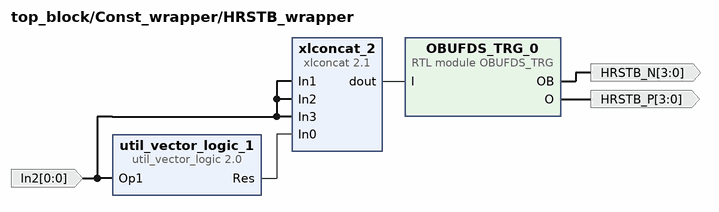
[diagram p16: block diagram inside /Const_wrapper/HRSTB_wrapper]
create_bd_pin -dir O -from 3 -to 0 -type clk HRSTB_N
create_bd_pin -dir O -from 3 -to 0 -type clk HRSTB_P
create_bd_pin -dir I -from 0 -to 0 In2

create_bd_cell -type ip -vlnv xilinx.com:ip:xlconcat:2.1 xlconcat_2
set_property -dict [list \
  CONFIG.IN0_WIDTH 1 \
  CONFIG.IN1_WIDTH 1 \
  CONFIG.IN2_WIDTH 1 \
  CONFIG.IN3_WIDTH 1 \
  CONFIG.NUM_PORTS 4 \
] [get_bd_cells xlconcat_2]
create_bd_cell -type ip -vlnv xilinx.com:ip:util_vector_logic:2.0 util_vector_logic_1
set_property -dict {CONFIG.C_OPERATION not CONFIG.C_SIZE 1} [get_bd_cells util_vector_logic_1]
create_bd_cell -type module -reference OBUFDS_TRG OBUFDS_TRG_0

# ---- hierarchy /GPIO_Slicer ----
current_bd_instance /GPIO_Slicer
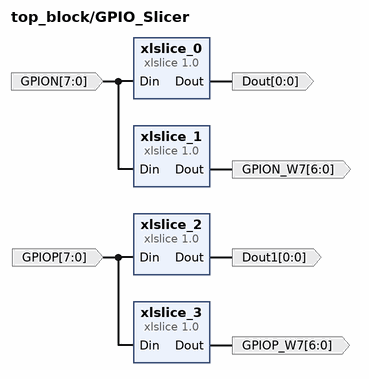
[diagram p17: block diagram inside /GPIO_Slicer]
create_bd_pin -dir I -from 7 -to 0 GPION
create_bd_pin -dir I -from 7 -to 0 GPIOP
create_bd_pin -dir O -from 6 -to 0 GPION_W7
create_bd_pin -dir O -from 6 -to 0 GPIOP_W7
create_bd_pin -dir O -from 0 -to 0 Dout
create_bd_pin -dir O -from 0 -to 0 Dout1

create_bd_cell -type ip -vlnv xilinx.com:ip:xlslice:1.0 xlslice_0
set_property -dict {CONFIG.DIN_FROM 7 CONFIG.DIN_TO 7 CONFIG.DIN_WIDTH 8} [get_bd_cells xlslice_0]
create_bd_cell -type ip -vlnv xilinx.com:ip:xlslice:1.0 xlslice_1
set_property -dict {CONFIG.DIN_FROM 6 CONFIG.DIN_TO 0 CONFIG.DIN_WIDTH 8} [get_bd_cells xlslice_1]
create_bd_cell -type ip -vlnv xilinx.com:ip:xlslice:1.0 xlslice_2
set_property -dict {CONFIG.DIN_FROM 7 CONFIG.DIN_TO 7 CONFIG.DIN_WIDTH 8} [get_bd_cells xlslice_2]
create_bd_cell -type ip -vlnv xilinx.com:ip:xlslice:1.0 xlslice_3
set_property -dict {CONFIG.DIN_FROM 6 CONFIG.DIN_TO 0 CONFIG.DIN_WIDTH 8} [get_bd_cells xlslice_3]

# ---- connections ----

current_bd_instance /led_module
connect_bd_intf_net [get_bd_intf_pins m00_axi] [get_bd_intf_pins LED_REG_READ_SEPARAT_0/m00_axi]
connect_bd_intf_net [get_bd_intf_pins m00_axi1] [get_bd_intf_pins LED_REG_READ_SEPARAT_1/m00_axi]
connect_bd_net [get_bd_pins DIP_SW] [get_bd_pins u_led_inst_0/DIPSW]
connect_bd_net [get_bd_pins LED_REG_READ_SEPARAT_0/LED_REG] [get_bd_pins u_led_inst_0/LED_REG2]
connect_bd_net [get_bd_pins LED_REG_READ_SEPARAT_0/m00_axi_txn_done] [get_bd_pins util_vector_logic_0/Op1]
connect_bd_net [get_bd_pins LED_REG_READ_SEPARAT_1/LED_REG] [get_bd_pins u_led_inst_0/LED_REG3]
connect_bd_net [get_bd_pins LED_REG_READ_SEPARAT_1/m00_axi_txn_done] [get_bd_pins util_vector_logic_0/Op2]
connect_bd_net [get_bd_pins clk125MHz] \
  [get_bd_pins LED_REG_READ_SEPARAT_0/m00_axi_aclk] [get_bd_pins LED_REG_READ_SEPARAT_1/m00_axi_aclk] \
  [get_bd_pins u_led_inst_0/clk125MHz]
connect_bd_net [get_bd_pins ext_clk_lkd] [get_bd_pins u_led_inst_0/ext_clk_lkd]
connect_bd_net [get_bd_pins fnet_txn] [get_bd_pins u_led_inst_0/fnet_txn]
connect_bd_net [get_bd_pins m00_axi_aresetn] [get_bd_pins LED_REG_READ_SEPARAT_0/m00_axi_aresetn] [get_bd_pins LED_REG_READ_SEPARAT_1/m00_axi_aresetn]
connect_bd_net [get_bd_pins power_on] [get_bd_pins u_led_inst_0/power_on]
connect_bd_net [get_bd_pins reset] [get_bd_pins u_led_inst_0/reset]
connect_bd_net [get_bd_pins u_led_inst_0/INIT_AXI_TXN] [get_bd_pins LED_REG_READ_SEPARAT_0/m00_axi_init_axi_txn]
connect_bd_net [get_bd_pins u_led_inst_0/INIT_AXI_TXN_SUB] [get_bd_pins LED_REG_READ_SEPARAT_1/m00_axi_init_axi_txn]
connect_bd_net [get_bd_pins u_led_inst_0/LED] [get_bd_pins LED]
connect_bd_net [get_bd_pins util_vector_logic_0/Res] [get_bd_pins u_led_inst_0/LED_TXN_DONE]
connect_bd_net [get_bd_pins xlconstant_0/dout] [get_bd_pins u_led_inst_0/enable]

current_bd_instance /reset
connect_bd_net [get_bd_pins RST] \
  [get_bd_pins xpm_cdc_gen_0/src_arst] [get_bd_pins xpm_cdc_gen_1/src_arst] [get_bd_pins xpm_cdc_gen_2/src_arst] \
  [get_bd_pins xpm_cdc_gen_3/src_arst]
connect_bd_net -net dest_clk1_1 [get_bd_pins dest_clk1] [get_bd_pins xpm_cdc_gen_3/dest_clk] [get_bd_pins rst_clk_wiz_0_300M2/slowest_sync_clk]
connect_bd_net [get_bd_pins dest_clk] [get_bd_pins xpm_cdc_gen_2/dest_clk] [get_bd_pins rst_clk_wiz_0_300M1/slowest_sync_clk]
connect_bd_net [get_bd_pins ext_reset_in] [get_bd_pins rst_clk_wiz_1_320M/ext_reset_in]
connect_bd_net -net rst_clk_wiz_0_125M1_peripheral_aresetn [get_bd_pins rst_clk_wiz_0_300M1/peripheral_aresetn] [get_bd_pins peripheral_aresetn3]
connect_bd_net [get_bd_pins rst_clk_wiz_0_125M/peripheral_aresetn] [get_bd_pins peripheral_aresetn]
connect_bd_net [get_bd_pins rst_clk_wiz_0_300M2/peripheral_aresetn] [get_bd_pins peripheral_aresetn4]
connect_bd_net [get_bd_pins rst_clk_wiz_1_320M1/peripheral_aresetn] [get_bd_pins peripheral_aresetn2]
connect_bd_net [get_bd_pins rst_clk_wiz_1_320M/peripheral_aresetn] [get_bd_pins peripheral_aresetn1]
connect_bd_net -net slowest_sync_clk1_1 [get_bd_pins slowest_sync_clk1] \
  [get_bd_pins rst_clk_wiz_1_320M/slowest_sync_clk] [get_bd_pins xpm_cdc_gen_1/dest_clk] \
  [get_bd_pins rst_clk_wiz_1_320M1/slowest_sync_clk]
connect_bd_net [get_bd_pins slowest_sync_clk] \
  [get_bd_pins rst_clk_wiz_0_125M/slowest_sync_clk] [get_bd_pins vio_0/clk] [get_bd_pins xpm_cdc_gen_0/dest_clk]
connect_bd_net [get_bd_pins vio_0/probe_out0] [get_bd_pins probe_out0]
connect_bd_net [get_bd_pins xpm_cdc_gen_0/dest_arst] [get_bd_pins rst_clk_wiz_0_125M/ext_reset_in]
connect_bd_net [get_bd_pins xpm_cdc_gen_1/dest_arst] [get_bd_pins rst_clk_wiz_1_320M1/ext_reset_in]
connect_bd_net [get_bd_pins xpm_cdc_gen_2/dest_arst] [get_bd_pins rst_clk_wiz_0_300M1/ext_reset_in]
connect_bd_net [get_bd_pins xpm_cdc_gen_3/dest_arst] [get_bd_pins rst_clk_wiz_0_300M2/ext_reset_in]

current_bd_instance /reg_bram
connect_bd_intf_net [get_bd_intf_pins S_AXI] [get_bd_intf_pins axi_bram_ctrl_0/S_AXI]
connect_bd_intf_net [get_bd_intf_pins S_AXI1] [get_bd_intf_pins axi_bram_ctrl_1/S_AXI]
connect_bd_intf_net [get_bd_intf_pins axi_bram_ctrl_0/BRAM_PORTA] [get_bd_intf_pins blk_mem_gen_0/BRAM_PORTA]
connect_bd_intf_net [get_bd_intf_pins axi_bram_ctrl_1/BRAM_PORTA] [get_bd_intf_pins blk_mem_gen_0/BRAM_PORTB]
connect_bd_net [get_bd_pins s_axi_aclk] [get_bd_pins axi_bram_ctrl_1/s_axi_aclk] [get_bd_pins axi_bram_ctrl_0/s_axi_aclk]
connect_bd_net [get_bd_pins s_axi_aresetn] [get_bd_pins axi_bram_ctrl_1/s_axi_aresetn] [get_bd_pins axi_bram_ctrl_0/s_axi_aresetn]

current_bd_instance /SAMPA_I2C_wrapper
connect_bd_intf_net [get_bd_intf_pins m00_axi] [get_bd_intf_pins I2C_Controller_v1_0_0/m00_axi]
connect_bd_intf_net [get_bd_intf_pins axi_iic_0/S_AXI] [get_bd_intf_pins I2C_Controller_v1_0_0/m01_axi]
connect_bd_intf_net [get_bd_intf_pins m00_axi1] [get_bd_intf_pins init_i2c_v1_0_0/m00_axi]
connect_bd_net [get_bd_pins S_I2C_SDA] [get_bd_pins iobuf_vhdl_1/io]
connect_bd_net [get_bd_pins S_I2C_SCL] [get_bd_pins iobuf_vhdl_0/io]
connect_bd_net [get_bd_pins axi_iic_0/scl_o] [get_bd_pins iobuf_vhdl_0/i]
connect_bd_net [get_bd_pins axi_iic_0/scl_t] [get_bd_pins iobuf_vhdl_0/t]
connect_bd_net [get_bd_pins axi_iic_0/sda_o] [get_bd_pins iobuf_vhdl_1/i]
connect_bd_net [get_bd_pins axi_iic_0/sda_t] [get_bd_pins iobuf_vhdl_1/t]
connect_bd_net [get_bd_pins init_i2c_v1_0_0/init_i2c_rd] [get_bd_pins I2C_Controller_v1_0_0/start_i2c_read]
connect_bd_net [get_bd_pins init_i2c_v1_0_0/init_i2c_wr] [get_bd_pins I2C_Controller_v1_0_0/start_i2c_write]
connect_bd_net [get_bd_pins iobuf_vhdl_0/o] [get_bd_pins axi_iic_0/scl_i]
connect_bd_net [get_bd_pins iobuf_vhdl_1/o] [get_bd_pins axi_iic_0/sda_i]
connect_bd_net [get_bd_pins m00_axi_aclk] [get_bd_pins I2C_Controller_v1_0_0/m00_axi_aclk] [get_bd_pins init_i2c_v1_0_0/m00_axi_aclk]
connect_bd_net [get_bd_pins m00_axi_aresetn] \
  [get_bd_pins axi_iic_0/s_axi_aresetn] [get_bd_pins I2C_Controller_v1_0_0/m00_axi_aresetn] \
  [get_bd_pins I2C_Controller_v1_0_0/m01_axi_aresetn] [get_bd_pins init_i2c_v1_0_0/m00_axi_aresetn]
connect_bd_net [get_bd_pins s_axi_aclk] [get_bd_pins axi_iic_0/s_axi_aclk] [get_bd_pins I2C_Controller_v1_0_0/m01_axi_aclk]

current_bd_instance /appUnit
connect_bd_intf_net [get_bd_intf_pins M_AXIS_data] [get_bd_intf_pins axis_data_fifo_0/M_AXIS]
connect_bd_intf_net [get_bd_intf_pins data_sender_v1_0_0/s_axis] [get_bd_intf_pins axis_data_fifo_0/S_AXIS]
connect_bd_net [get_bd_pins Din] [get_bd_pins xlslice_0/Din]
connect_bd_net [get_bd_pins FIFO_logic/fifos_out] [get_bd_pins cs_data_processor_0/fifo_data_i]
connect_bd_net -net asyncfifo_0_mem_full [get_bd_pins FIFO_logic/mem_full3] [get_bd_pins cs_appunit_merge_0/full_0]
connect_bd_net -net asyncfifo_1_mem_full [get_bd_pins FIFO_logic/mem_full1] [get_bd_pins cs_appunit_merge_0/full_1]
connect_bd_net -net asyncfifo_2_mem_full [get_bd_pins FIFO_logic/mem_full2] [get_bd_pins cs_appunit_merge_0/full_2]
connect_bd_net -net asyncfifo_3_mem_full [get_bd_pins FIFO_logic/mem_full] [get_bd_pins cs_appunit_merge_0/full_3]
connect_bd_net [get_bd_pins axis_data_fifo_0/prog_full] [get_bd_pins data_sender_v1_0_0/full]
connect_bd_net -net clk1_1 [get_bd_pins clk125MHz] \
  [get_bd_pins FIFO_logic/clk125MHz] [get_bd_pins data_sender_v1_0_0/clk] [get_bd_pins axis_data_fifo_0/s_axis_aclk] \
  [get_bd_pins cs_event_builder_0/clk] [get_bd_pins cs_data_processor_0/clk]
connect_bd_net -net clk1_2 [get_bd_pins clk1] [get_bd_pins FIFO_logic/clk1]
connect_bd_net [get_bd_pins clk] \
  [get_bd_pins FIFO_logic/clk] [get_bd_pins cs_das_rx_0/clk_SO] [get_bd_pins threshold_comparator_0/clk] \
  [get_bd_pins trigger_manager_0/clk]
connect_bd_net [get_bd_pins clk_enable_1MHz] [get_bd_pins trigger_manager_0/clk_enable_1MHz]
connect_bd_net [get_bd_pins clk_enable_1kHz] [get_bd_pins trigger_manager_0/clk_enable_1kHz]
connect_bd_net -net cs_appunit_fifo_out_0_fifos_empty [get_bd_pins FIFO_logic/fifos_empty] [get_bd_pins cs_data_processor_0/fifo_empty]
connect_bd_net [get_bd_pins cs_appunit_merge_0/SOs] [get_bd_pins threshold_comparator_0/signals]
connect_bd_net [get_bd_pins cs_appunit_merge_0/fulls] [get_bd_pins cs_das_rx_0/fifo_full]
connect_bd_net [get_bd_pins cs_das_rx_0/buses] [get_bd_pins cs_fifo_slicer_0/buses]
connect_bd_net [get_bd_pins cs_das_rx_0/reset_fifos] [get_bd_pins cs_fifo_slicer_0/reset_fifos]
connect_bd_net [get_bd_pins cs_das_rx_0/wr_ens] [get_bd_pins cs_fifo_slicer_0/wr_ens]
connect_bd_net [get_bd_pins cs_data_processor_0/bus_sel] [get_bd_pins cs_event_builder_0/bus_sel]
connect_bd_net [get_bd_pins cs_data_processor_0/counter] [get_bd_pins cs_event_builder_0/counter]
connect_bd_net [get_bd_pins cs_data_processor_0/data_out] [get_bd_pins cs_event_builder_0/data]
connect_bd_net [get_bd_pins cs_data_processor_0/fifo_req] [get_bd_pins cs_fifo_slicer_0/request_fifos]
connect_bd_net [get_bd_pins cs_data_processor_0/last_data] [get_bd_pins cs_event_builder_0/last_data]
connect_bd_net [get_bd_pins cs_data_processor_0/sample] [get_bd_pins cs_event_builder_0/sample_n]
connect_bd_net [get_bd_pins cs_data_processor_0/valid] [get_bd_pins cs_event_builder_0/valid]
connect_bd_net [get_bd_pins cs_event_builder_0/busy] [get_bd_pins cs_data_processor_0/busy_i]
connect_bd_net [get_bd_pins cs_event_builder_0/data_ack_reg] [get_bd_pins cs_data_processor_0/ack]
connect_bd_net [get_bd_pins cs_event_builder_0/event_word] [get_bd_pins data_sender_v1_0_0/wr_data]
connect_bd_net [get_bd_pins cs_event_builder_0/event_write] [get_bd_pins data_sender_v1_0_0/wr_en]
connect_bd_net [get_bd_pins cs_fifo_slicer_0/bus_0] [get_bd_pins FIFO_logic/data_in3]
connect_bd_net [get_bd_pins cs_fifo_slicer_0/bus_1] [get_bd_pins FIFO_logic/data_in1]
connect_bd_net [get_bd_pins cs_fifo_slicer_0/bus_2] [get_bd_pins FIFO_logic/data_in2]
connect_bd_net [get_bd_pins cs_fifo_slicer_0/bus_3] [get_bd_pins FIFO_logic/data_in]
connect_bd_net [get_bd_pins cs_fifo_slicer_0/request_fifo_0] [get_bd_pins FIFO_logic/read_en3]
connect_bd_net [get_bd_pins cs_fifo_slicer_0/request_fifo_1] [get_bd_pins FIFO_logic/read_en1]
connect_bd_net [get_bd_pins cs_fifo_slicer_0/request_fifo_2] [get_bd_pins FIFO_logic/read_en2]
connect_bd_net [get_bd_pins cs_fifo_slicer_0/request_fifo_3] [get_bd_pins FIFO_logic/read_en]
connect_bd_net [get_bd_pins cs_fifo_slicer_0/reset_fifo_0] [get_bd_pins FIFO_logic/reset3]
connect_bd_net [get_bd_pins cs_fifo_slicer_0/reset_fifo_1] [get_bd_pins FIFO_logic/reset1]
connect_bd_net [get_bd_pins cs_fifo_slicer_0/reset_fifo_2] [get_bd_pins FIFO_logic/reset2]
connect_bd_net [get_bd_pins cs_fifo_slicer_0/reset_fifo_3] [get_bd_pins FIFO_logic/reset]
connect_bd_net [get_bd_pins cs_fifo_slicer_0/wr_en_0] [get_bd_pins FIFO_logic/write_en3]
connect_bd_net [get_bd_pins cs_fifo_slicer_0/wr_en_1] [get_bd_pins FIFO_logic/write_en1]
connect_bd_net [get_bd_pins cs_fifo_slicer_0/wr_en_2] [get_bd_pins FIFO_logic/write_en2]
connect_bd_net [get_bd_pins cs_fifo_slicer_0/wr_en_3] [get_bd_pins FIFO_logic/write_en]
connect_bd_net [get_bd_pins data_sender_v1_0_0/busy] [get_bd_pins cs_event_builder_0/busy_i]
connect_bd_net [get_bd_pins en] [get_bd_pins cs_das_rx_0/en] [get_bd_pins threshold_comparator_0/enable] [get_bd_pins FIFO_logic/en]
connect_bd_net [get_bd_pins event_reset] \
  [get_bd_pins data_sender_v1_0_0/rst] [get_bd_pins cs_event_builder_0/event_reset] \
  [get_bd_pins cs_data_processor_0/event_reset]
connect_bd_net [get_bd_pins internal_enabled] [get_bd_pins threshold_comparator_0/external_disabled] [get_bd_pins trigger_manager_0/external_disabled]
connect_bd_net [get_bd_pins n_samples] [get_bd_pins cs_das_rx_0/n_samples]
connect_bd_net [get_bd_pins pretrigger_select] [get_bd_pins threshold_comparator_0/pretrigger_select]
connect_bd_net -net probe_in0_1 [get_bd_pins SO0] [get_bd_pins cs_appunit_merge_0/SO_0] [get_bd_pins trigger_manager_0/SO0]
connect_bd_net -net probe_in1_1 [get_bd_pins SO1] [get_bd_pins cs_appunit_merge_0/SO_1]
connect_bd_net -net probe_in2_1 [get_bd_pins SO2] [get_bd_pins cs_appunit_merge_0/SO_2]
connect_bd_net -net probe_in3_1 [get_bd_pins SO3] [get_bd_pins cs_appunit_merge_0/SO_3]
connect_bd_net -net s_axis_aresetn_0_1 [get_bd_pins s_axis_aresetn_0] [get_bd_pins axis_data_fifo_0/s_axis_aresetn]
connect_bd_net [get_bd_pins select_ext] [get_bd_pins FIFO_logic/select_ext]
connect_bd_net [get_bd_pins threshold] [get_bd_pins threshold_comparator_0/threshold]
connect_bd_net [get_bd_pins threshold_comparator_0/delayed_signals] [get_bd_pins cs_das_rx_0/SOs]
connect_bd_net [get_bd_pins threshold_comparator_0/triggered] [get_bd_pins xlconcat_0/In0]
connect_bd_net [get_bd_pins trigger_manager_0/trg] [get_bd_pins xlconcat_0/In1]
connect_bd_net [get_bd_pins util_reduced_logic_0/Res] [get_bd_pins cs_das_rx_0/trg]
connect_bd_net [get_bd_pins xlconcat_0/dout] [get_bd_pins util_reduced_logic_0/Op1]
connect_bd_net [get_bd_pins xlslice_0/Dout] [get_bd_pins trigger_manager_0/external_trg]
